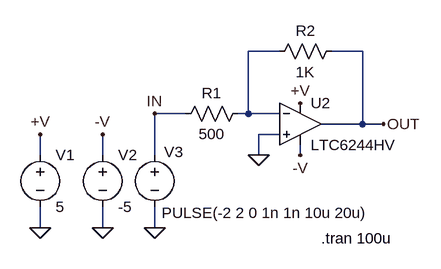
[diagram p0: schematic Fig_1-70_6244_PULSE-Test.asc]
Fig_1-70_6244_PULSE-Test.asc, the LTspice schematic file:
Version 4
SHEET 1 880 680
WIRE 336 240 288 240
WIRE 464 240 416 240
WIRE 192 336 144 336
WIRE 288 336 288 240
WIRE 288 336 272 336
WIRE 336 336 288 336
WIRE 464 352 464 240
WIRE 464 352 400 352
WIRE 496 352 464 352
WIRE 336 368 304 368
WIRE -32 400 -32 368
WIRE 64 400 64 368
WIRE 144 400 144 336
WIRE 304 400 304 368
WIRE 368 400 368 384
WIRE -32 512 -32 480
WIRE 64 512 64 480
WIRE 144 512 144 480
FLAG -32 512 0
FLAG 64 512 0
FLAG -32 368 +V
FLAG 144 512 0
FLAG 144 336 IN
FLAG 496 352 OUT
FLAG 368 320 +V
FLAG 64 368 -V
FLAG 368 400 -V
FLAG 304 400 0
SYMBOL voltage -32 384 R0
WINDOW 123 0 0 Left 2
WINDOW 39 0 0 Left 2
SYMATTR InstName V1
SYMATTR Value 5
SYMBOL voltage 64 384 R0
WINDOW 123 0 0 Left 2
WINDOW 39 0 0 Left 2
SYMATTR InstName V2
SYMATTR Value -5
SYMBOL voltage 144 384 R0
WINDOW 0 15 11 Left 2
WINDOW 3 11 105 Left 2
WINDOW 123 0 0 Left 0
WINDOW 39 0 0 Left 0
SYMATTR InstName V3
SYMATTR Value PULSE(-2 2 0 1n 1n 10u 20u)
SYMBOL Opamps\\LTC6244HV 368 352 R0
SYMATTR InstName U2
SYMBOL res 176 352 R270
WINDOW 0 32 56 VTop 2
WINDOW 3 0 56 VBottom 2
SYMATTR InstName R1
SYMATTR Value 500
SYMBOL res 320 256 R270
WINDOW 0 32 56 VTop 2
WINDOW 3 0 56 VBottom 2
SYMATTR InstName R2
SYMATTR Value 1K
TEXT 400 528 Left 2 !.tran 100u

The netlist it stands for:
* Fig_1-70_6244_PULSE-Test.asc
V1 +V 0 5
V2 -V 0 -5
V3 IN 0 PULSE(-2 2 0 1n 1n 10u 20u)
XU2 0 N001 +V -V OUT LTC6244HV  ; pins In+ In- V+ V- OUT
R1 IN N001 500
R2 N001 OUT 1K
.tran 100u
.lib LTC5.lib
.backanno
.end